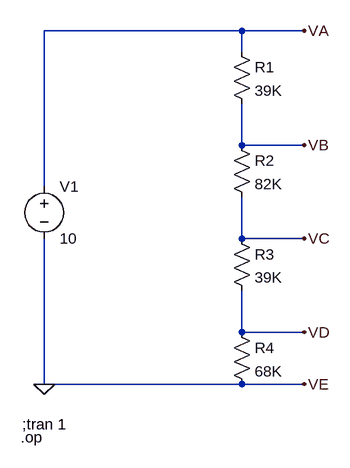
[diagram p0: schematic Lab1.asc]
Lab1.asc, the LTspice schematic file:
Version 4
SHEET 1 880 680
WIRE 352 -96 48 -96
WIRE 448 -96 352 -96
WIRE 352 -64 352 -96
WIRE 352 80 352 16
WIRE 448 80 352 80
WIRE 48 144 48 -96
WIRE 352 224 352 160
WIRE 448 224 352 224
WIRE 352 368 352 304
WIRE 448 368 352 368
WIRE 48 448 48 224
WIRE 352 448 48 448
WIRE 448 448 352 448
FLAG 48 448 0
FLAG 448 -96 VA
FLAG 448 80 VB
FLAG 448 224 VC
FLAG 448 368 VD
FLAG 448 448 VE
SYMBOL voltage 48 128 R0
WINDOW 123 0 0 Left 0
WINDOW 39 0 0 Left 0
SYMATTR InstName V1
SYMATTR Value 10
SYMBOL res 336 -80 R0
SYMATTR InstName R1
SYMATTR Value 39K
SYMBOL res 336 64 R0
SYMATTR InstName R2
SYMATTR Value 82K
SYMBOL res 336 208 R0
SYMATTR InstName R3
SYMATTR Value 39K
SYMBOL res 336 352 R0
SYMATTR InstName R4
SYMATTR Value 68K
TEXT 14 510 Left 2 !;tran 1
TEXT 12 530 Left 2 !.op

The netlist it stands for:
* Lab1.asc
V1 VA 0 10
R1 VA VB 39K
R2 VB VC 82K
R3 VC VD 39K
R4 VD 0 68K
;tran 1
.op
.backanno
.end